# EAGLE design sensors_board (EAGLE 9.6.0)
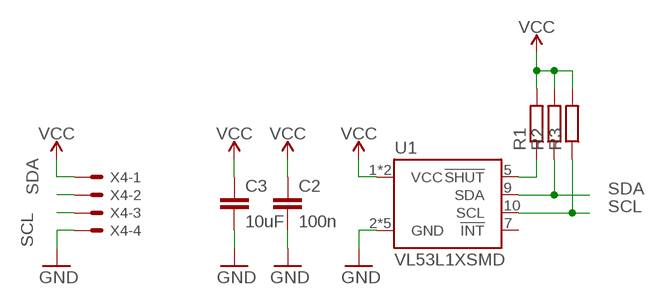
[diagram p0: schematic, sheet 1]

## Parts
C2  100n  C-EUC0805  [C0805]
C3  10uF  C-EUC0805  [C0805]
R1  R-EU_M0805  [M0805]
R2  R-EU_M0805  [M0805]
R3  R-EU_M0805  [M0805]
U1  VL53L1XSMD  [VL53L1X]
X4  52745-0490  [52745-0490]

## Nets
GND: C2.2 C3.2 U1.2(GND) U1.3(GND) U1.4(GND) U1.6(GND) U1.12(GND) X4.4
N$1: R1.1 U1.5(!SHUT)
SCL: R3.1 U1.10(SCL) X4.3
SDA: R2.1 U1.9(SDA) X4.2
VCC: C2.1 C3.1 R1.2 R2.2 R3.2 U1.1(VCC) U1.11(VCC) X4.1
Unconnected: U1.7(!INT)

## Library data of the parts
C2 C3 = rcl:C-EU: CAPACITOR, European symbol; SPICEPREFIX: C
R1-R3 = rcl:R-EU_: RESISTOR, European symbol; SPICEPREFIX: R
U1 = SparkFun-Sensors:VL53L1X: STMicroelectronics VL53L1X - 400 cm IR Laser ToF Sensor VL53L1X is a state-of-the-art ToF laser-ranging sensor, enhancing the ST FlightSense product family. It is the fastest miniature ToF sensor currently on the market with accurate ranging up to 4 m and fast ranging frequency (up to 50 Hz). Housed in a miniature and reflowable package, it integrates a single photon avalanche diode (SPAD) receiving array, a 940 nm invisible laser Class 1 emitter, physical infrared filters, and optics to achieve the best ranging performance in various ambient lighting conditions with a range of cover window options.; PROD_ID: IC-13960
X4 = con-molex:52745-0490: FFC/FPC-to-Board 0.50mm (.020") SMT Top Contact Right Angle, ZIF, Style Receptacle 52745 / 52435 Source: http://www.molex.com/product/ffc/52745.html; MF: MOLEX; MPN: 52745-0490; OC_FARNELL: unknown; OC_NEWARK: 61H4699

## Board
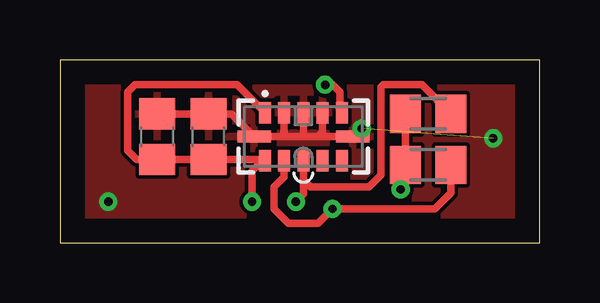
[diagram p1: board, top side]
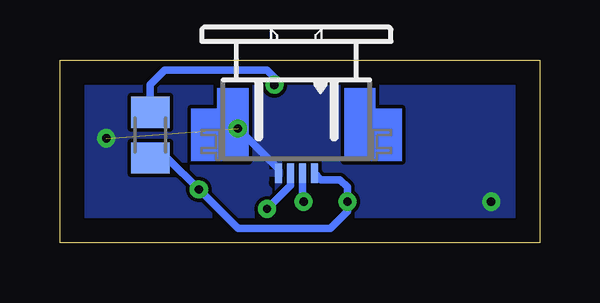
[diagram p2: board, bottom side, seen from below]

Size 20 x 7.64 mm. Coordinates in mm from the lower left corner, seen from the top.
Outline: 0,0 20,0 20,7.64 0,7.64 0,0
Copper layers (1*16): Top 0.035mm / dielectric 1.5mm / Bottom 0.035mm
Design rules "default": minimum track width 6mil, minimum drill 0.35mm, track to track 6mil, track to pad 6mil, pad to pad 6mil, via to via 6mil, smd to smd 6mil, copper to edge 40mil, drill to drill 6mil, minimum pad ring 10mil, minimum via ring 8mil, stop-mask expansion 4mil, vias tented up to drill 0mil, thermal gap 10mil

### Footprints (pad centres in the part's own frame; a part is rotated, then mirrored left to right if it is on the bottom)
C0805 = smd 1.3 x 1.5: 1 -0.95,0; 2 0.95,0
M0805 = smd 1.3 x 1.6: 1 -0.95,0; 2 0.95,0
VL53L1X = smd 0.5 x 0.9: 1 1.6,-1; 2 0.8,-1; 3 0,-1; 4 -0.8,-1; 5 -1.6,-1; 7 -1.6,1; 8 -0.8,1; 9 0,1; 10 0.8,1; 11 1.6,1 | smd 1.4 x 0.5: 6 -2.05,0; 12 2.05,0
52745-0490 = smd 0.3 x 0.8: 1 -0.75,2.5; 2 -0.25,2.5; 3 0.25,2.5; 4 0.75,2.5

### Placement (x,y rotation side)
C2  4.05,4.44 90 top
C3  6.19,4.44 90 top
R1  16.23,4.5 270 bottom
R2  15.36,5.39 180 top
R3  15.36,3.26 180 top
U1  10.15,4.44 180 top
X4  10.14,5.42 180 bottom

### Tracks (layer width: path | path; a pad name or v marks a point on that pad's centre or on a via)
GND  (via drill 0.35)  (1 unrouted)
  Top 0.305: C2.2 C3.2 7.16,5.38 U1.12 9.23,4.44 | 9.23,4.44 10.14,4.44 | 10.14,4.44 10.75,4.44 | 10.75,4.44 U1.6 12.25,4.44 v12.58,4.78 | U1.2 9.35,4.56 9.23,4.44 | U1.3 10.15,4.45 10.14,4.44 | U1.4 10.95,4.64 10.75,4.44
  Bottom 0.305: v12.58,4.78 10.89,3.08 X4.4
  other vias: 2.02,1.73 18.07,4.37
  pour Bottom: -0.83,8.74 21.52,8.74 21.52,-1.42 -0.83,-1.42
  pour Top: -0.42,9.75 20.51,9.75 20.51,-2.03 -0.42,-2.03
N$1  (via drill 0.35)
  Top 0.305: U1.5 11.67,5.52 11.67,6.3 11.36,6.6 v11.06,6.6
  Bottom 0.305: v11.06,6.6 11.06,6.91 11.36,7.21 15.63,7.21 16.23,6.61 R1.1
SCL  (via drill 0.35)
  Top 0.305: U1.10 9.35,2.76 8.93,2.34 8.93,1.42 9.53,0.81 10.75,0.81 v11.36,1.42 15.63,1.42 16.31,2.1 R3.1
  Bottom 0.305: X4.3 10.39,2.4 v11.36,1.42
SDA  (via drill 0.35)
  Top 0.305: U1.9 10.15,2.64 | 10.15,2.64 10.15,2.04 v9.84,1.73 | R2.1 15.09,6.6 13.5,6.6 13.39,6.5 13.39,2.84 12.89,2.34 10.46,2.34 10.15,2.64
  Bottom 0.305: X4.2 9.89,1.78 v9.84,1.73
VCC  (via drill 0.35)
  Top 0.305: 8.5,3.49 C3.1 C2.1 3.2,3.49 2.83,3.86 2.83,6.3 3.13,6.6 7.39,6.6 U1.1 | 8.5,3.49 U1.11 | v8.01,1.73 8.01,3 8.5,3.49 | R2.2 R3.2 14.41,2.43 v14.21,2.23
  Bottom 0.305: X4.1 9.11,2.64 8.32,2.64 8.01,2.34 v8.01,1.73 8.01,1.32 8.72,0.61 12.58,0.61 v14.21,2.23 15.52,3.55 R1.2